# EAGLE design Lattepanda_shild_v1 (EAGLE 6.5.0)
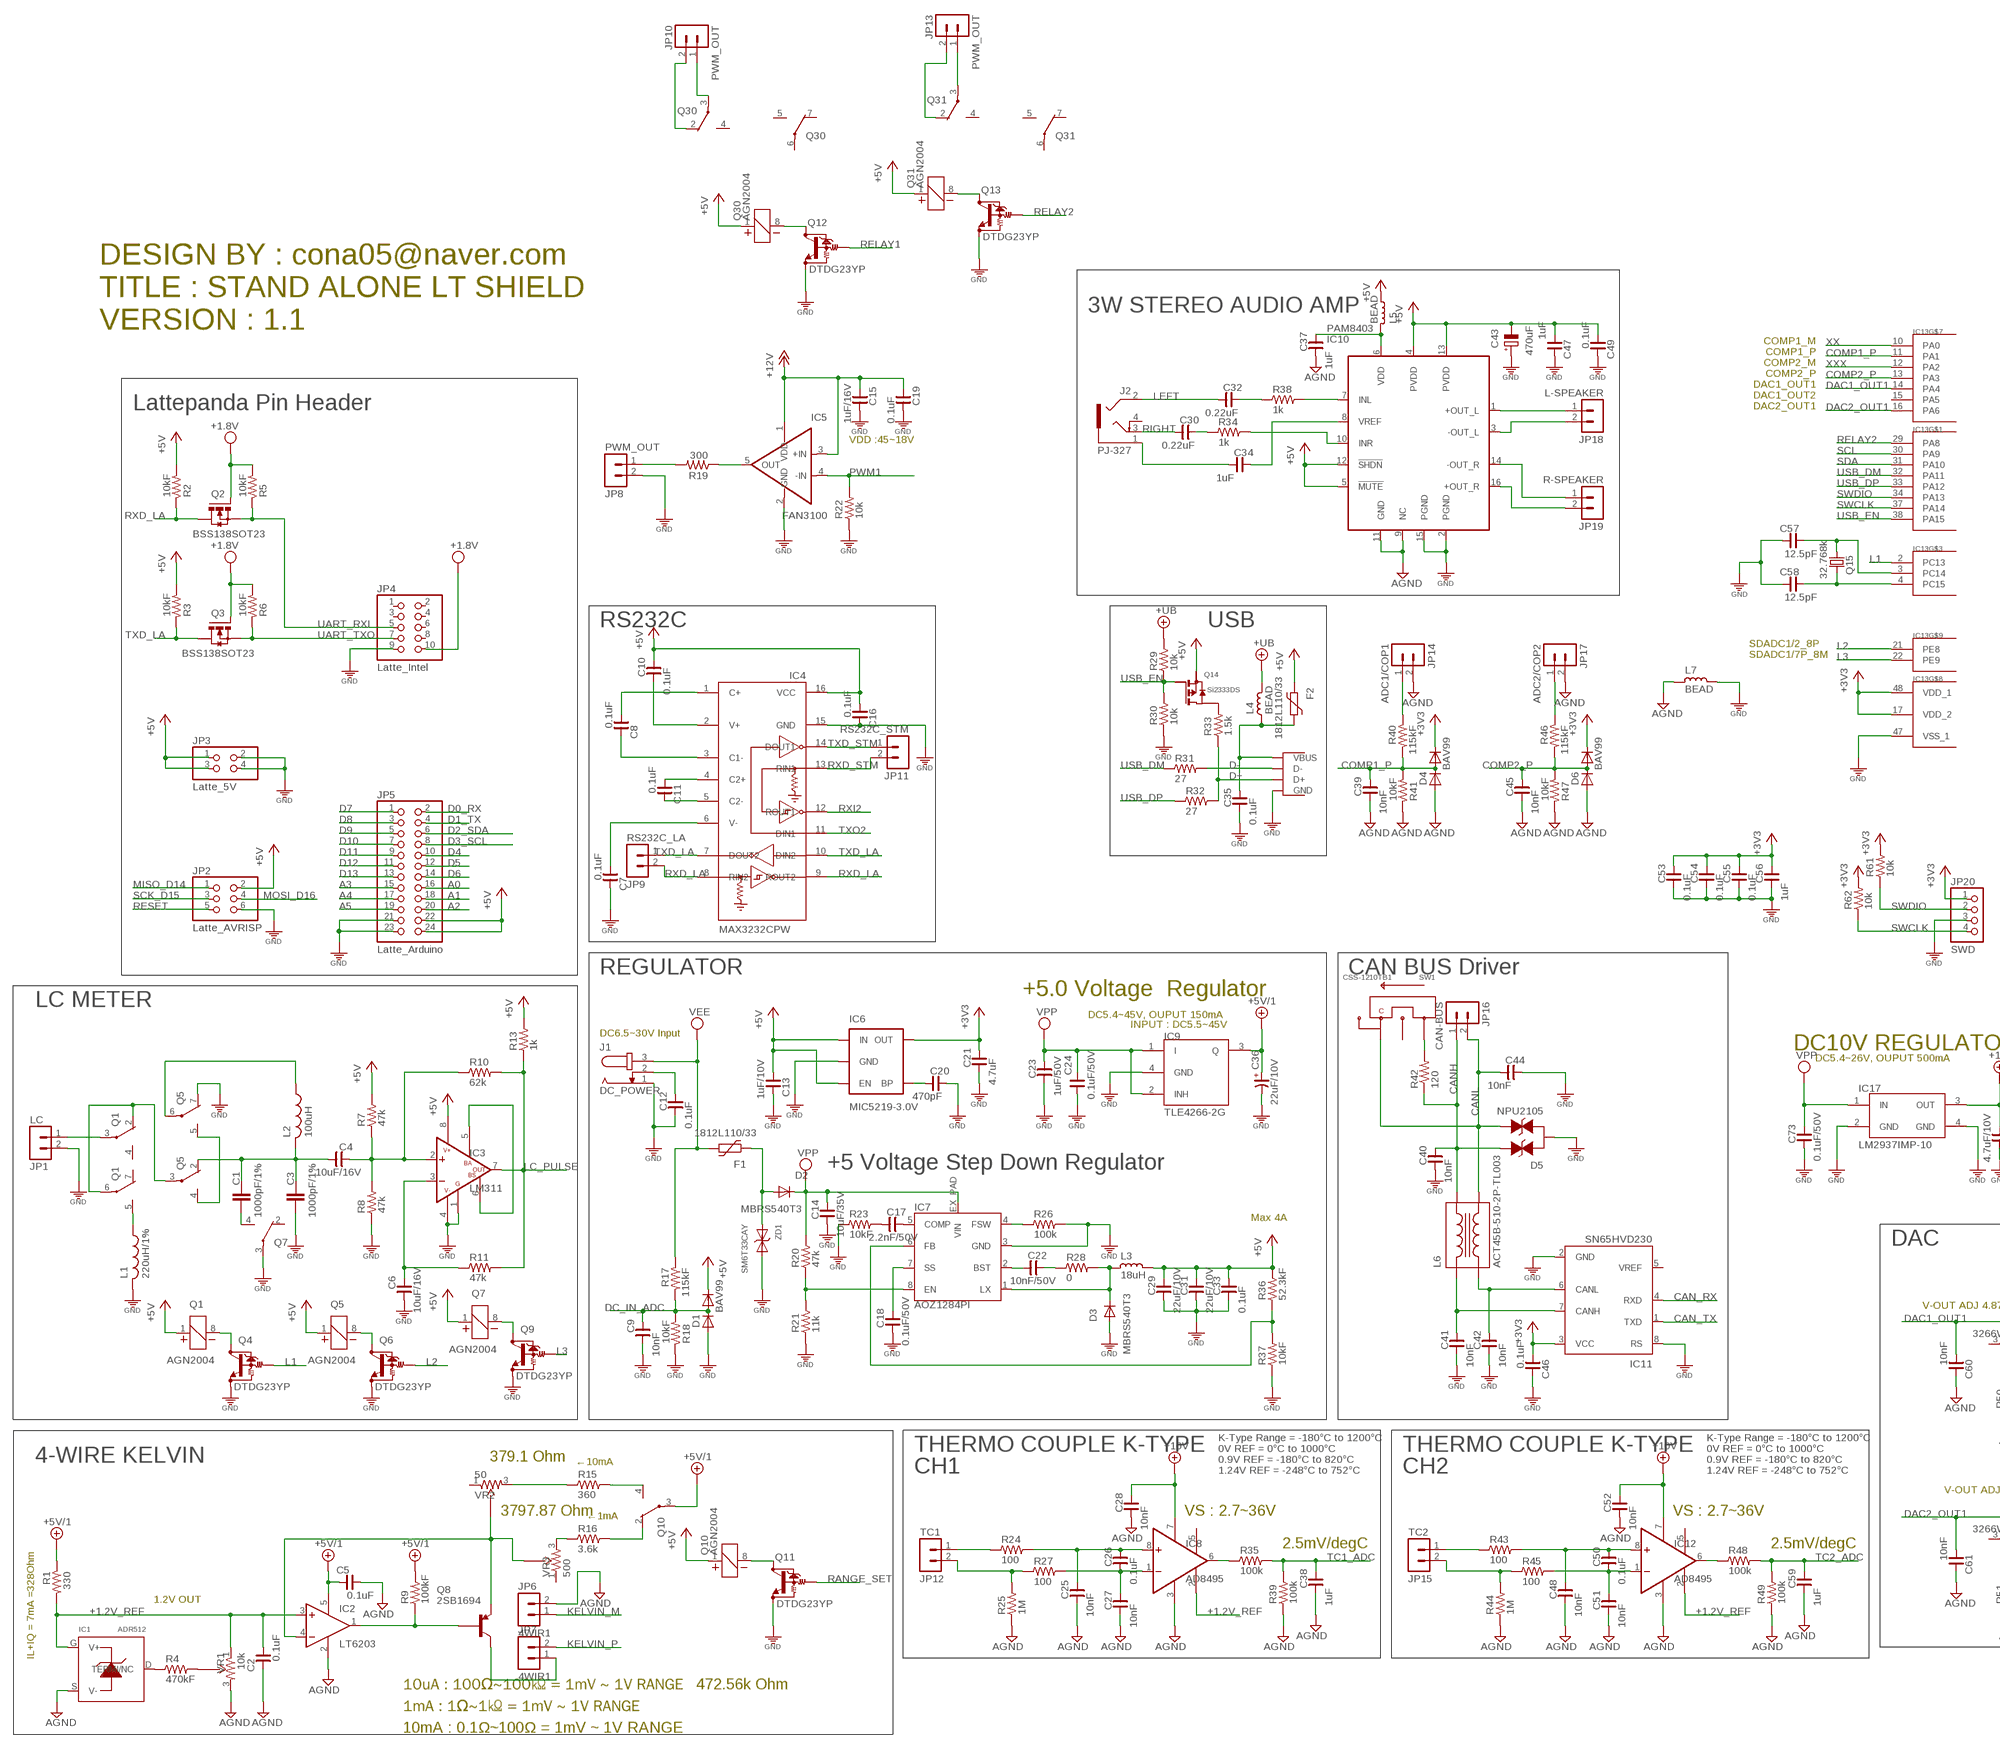
[diagram p0: schematic, sheet 1, part 1 of 2]
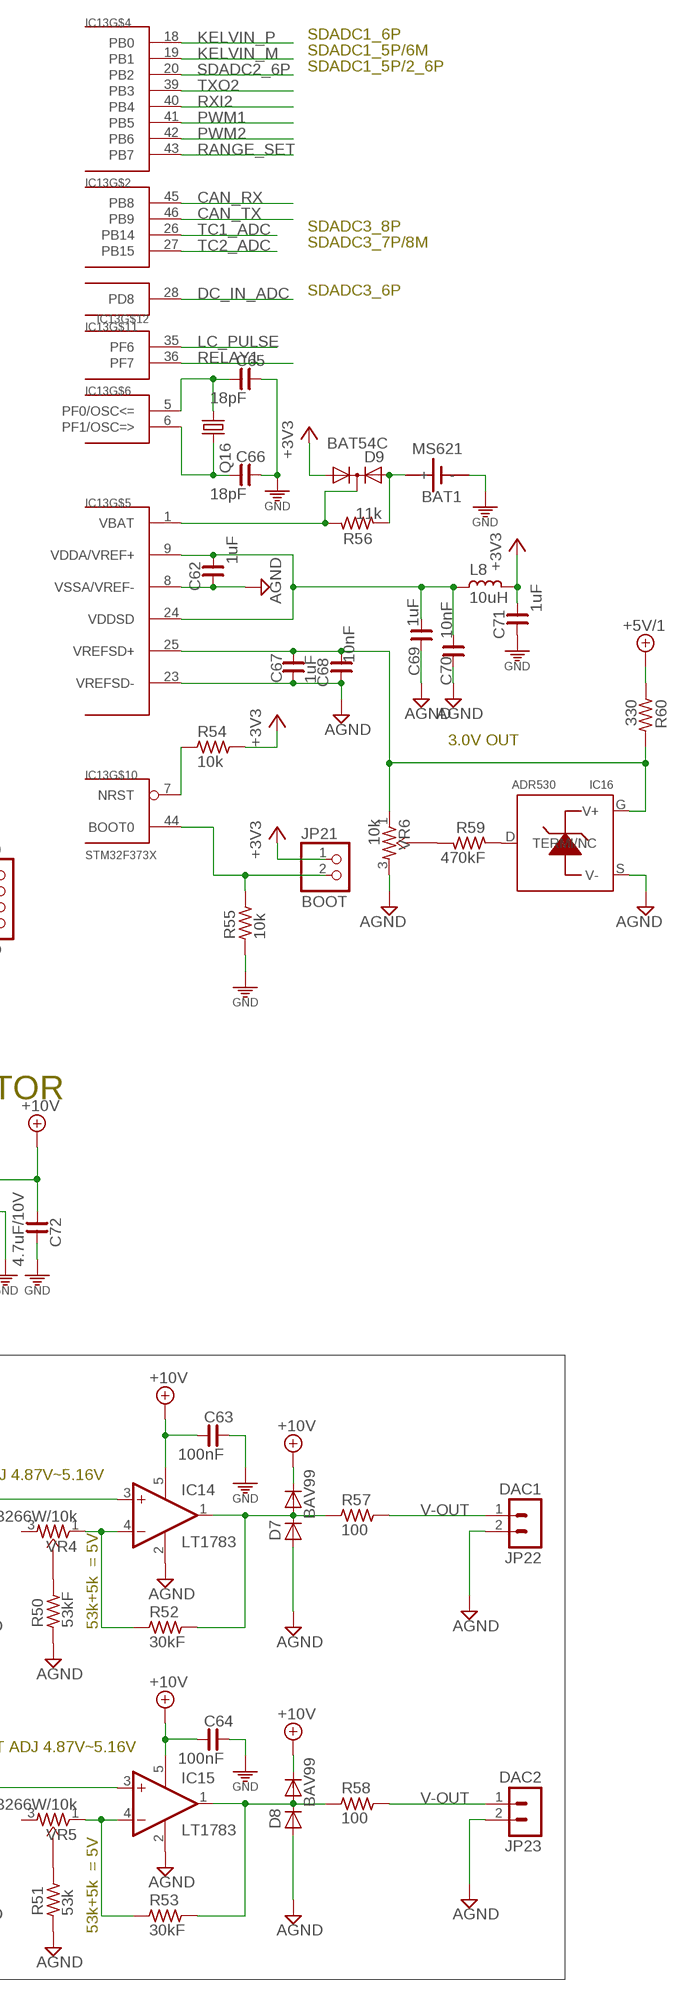
[diagram p1: schematic, sheet 1, part 2 of 2]

## Parts
BAT1  MS621  MS614  [MS621]
C1  1000pF/1%  C-EU050-025X075  [C050-025X075]
C2  0.1uF  C_0603  [C0603]
C3  1000pF/1%  C-EU050-025X075  [C050-025X075]
C4  10uF/16V  C_3216  [C3216]
C5  0.1uF  C_0603  [C0603]
C6  10uF/16V  C_3216  [C3216]
C7  0.1uF  C_0603  [C0603]
C8  0.1uF  C_0603  [C0603]
C9  10nF  C_0603  [C0603]
C10  0.1uF  C_0603  [C0603]
C11  0.1uF  C_0603  [C0603]
C12  0.1uF  C_0603  [C0603]
C13  1uF/10V  C_0603  [C0603]
C14  10uF/35V  C_3225  [C3225]
C15  1uF/16V  C_0805  [C0805]
C16  0.1uF  C_0603  [C0603]
C17  2.2nF/50V  C_0603  [C0603]
C18  0.1uF/50V  C_0603  [C0603]
C19  0.1uF  C_0603  [C0603]
C20  470pF  C_0603  [C0603]
C21  4.7uF  C_2012  [C2012]
C22  10nF/50V  C_0603  [C0603]
C23  1uF/50V  C_2012  [C2012]
C24  0.1uF/50V  C_0603  [C1608-]
C25  10nF  C_0603  [C0603]
C26  0.1uF  C_0603  [C0603]
C27  10nF  C_0603  [C0603]
C28  10nF  C_0603  [C0603]
C29  22uF/10V  C_3216  [C3216]
C30  0.22uF  C_0603  [C0603]
C31  22uF/10V  C_3216  [C3216]
C32  0.22uF  C_0603  [C0603]
C33  0.1uF  C_0603  [C0603]
C34  1uF  C_0603  [C0603]
C35  0.1uF  C_0603  [C0603]
C36  22uF/10V  CP_3528-21  [C3528-21/T]
C37  1uF  C_0603  [C0603]
C38  1uF  C_0603  [C0603]
C39  10nF  C_0603  [C0603]
C40  10nF  C_0603  [C0603]
C41  10nF  C_0603  [C0603]
C42  10nF  C_0603  [C0603]
C43  470uF  CPOL-EUD/7343-31W  [D/7343-31W]
C44  10nF  C_0603  [C0603]
C45  10nF  C_0603  [C0603]
C46  0.1uF  C_0603  [C0603]
C47  1uF  C_0603  [C0603]
C48  10nF  C_0603  [C0603]
C49  0.1uF  C_0603  [C0603]
C50  0.1uF  C_0603  [C0603]
C51  10nF  C_0603  [C0603]
C52  10nF  C_0603  [C0603]
C53  0.1uF  C_0603  [C0603]
C54  0.1uF  C_0603  [C0603]
C55  0.1uF  C_0603  [C0603]
C56  1uF  C_0603  [C0603]
C57  12.5pF  C_0603  [C0603]
C58  12.5pF  C_0603  [C0603]
C59  1uF  C_0603  [C0603]
C60  10nF  C_0603  [C0603]
C61  10nF  C_0603  [C0603]
C62  1uF  C_0603  [C0603]
C63  100nF  C_0603  [C0603]
C64  100nF  C_0603  [C0603]
C65  18pF  C_0603  [C0603]
C66  18pF  C_0603  [C0603]
C67  1uF  C_0603  [C0603]
C68  10nF  C_0603  [C0603]
C69  1uF  C_0603  [C0603]
C70  10nF  C_0603  [C0603]
C71  1uF  C_0603  [C0603]
C72  4.7uF/10V  C_2012  [C2012]
C73  0.1uF/50V  C_0603  [C0603]
D1  BAV99  [SOT23]
D2  MBRS540T3  DIODE-SMC  [SMC]
D3  MBRS540T3  DIODE-SMC  [SMC]
D4  BAV99  [SOT23]
D5  NPU2105  [SOT23]
D6  BAV99  [SOT23]
D7  BAV99  [SOT23]
D8  BAV99  [SOT23]
D9  BAT54C  [SOT23]
F1  1812L110/33  1812L  [1812L]
F2  1812L110/33  1812L  [1812L]
IC1  ADR512  ADR510  [SOT23]
IC2  LT6203  TS507S  [SOT23-5L]
IC3  LM311  [SO8]
IC4  MAX3232CPW  MAX3232MAX232CPW  [PW_R-PDSO-G16]
IC5  FAN3100  [SOT23-5L_FAN3100]
IC6  MIC5219-3.0V  V_REG_LDOSMD  [SOT23-5]
IC7  AOZ1284PI  [S08-EP1]
IC8  AD8495  AD849X  [MSOP8]
IC9  TLE4266-2G  TLE4266G  [SOT223-4]
IC10  PAM8403  [SOIC16N]
IC11  SN65HVD230  PCA82C250T  [SO8]
IC12  AD8495  AD849X  [MSOP8]
IC13  STM32F373X  [TQFP48]
IC14  LT1783  LT1783M5  [SOT23-5]
IC15  LT1783  LT1783M5  [SOT23-5]
IC16  ADR530  ADR510  [SOT23]
IC17  LM2937IMP-10  LM2937  [SOT223]
J1  DC_POWER  JACK-PLUG0  [SPC4077]
J2  PJ-327  AUDIO_JACK2  [PJ-327-2]
JP1  LC  MA02ED350V-02P  [ED350V-02P]
JP2  Latte_AVRISP  PINHD-2X3  [2X03]
JP3  Latte_5V  PINHD-2X2  [2X02]
JP4  Latte_Intel  PINHD-2X5M  [2X05M]
JP5  Latte_Arduino  PINHD-2X12SMD  [2X12_SMD]
JP6  4WIR1  MA02ED350V-02P  [ED350V-02P]
JP7  4WIR1  MA02ED350V-02P  [ED350V-02P]
JP8  PWM_OUT  MA02ED350V-02P  [ED350V-02P]
JP9  RS232C_LA  MA02ED350V-02P  [ED350V-02P]
JP10  PWM_OUT  MA02ED350V-02P  [ED350V-02P]
JP11  RS232C_STM  MA02ED350V-02P  [ED350V-02P]
JP12  TC1  MA02ED350V-02P  [ED350V-02P]
JP13  PWM_OUT  MA02ED350V-02P  [ED350V-02P]
JP14  ADC1/COP1  MA02ED350V-02P  [ED350V-02P]
JP15  TC2  MA02ED350V-02P  [ED350V-02P]
JP16  CAN-BUS  MA02ED350V-02P  [ED350V-02P]
JP17  ADC2/COP2  MA02ED350V-02P  [ED350V-02P]
JP18  L-SPEAKER  MA02ED350V-02P  [ED350V-02P]
JP19  R-SPEAKER  MA02ED350V-02P  [ED350V-02P]
JP20  SWD  PINHD-1X4M  [1X04M]
JP21  BOOT  PINHD-1X2M  [1X02M]
JP22  DAC1  MA02ED350V-02P  [ED350V-02P]
JP23  DAC2  MA02ED350V-02P  [ED350V-02P]
L1  220uH/1%  L-US0207/2V  [0207/2V]
L2  100uH  L-US0207/2V  [0207/2V]
L3  18uH  L_SHP1260P-F  [SHP1260P-F]
L4  BEAD  L_0805  [L0805]
L5  BEAD  L_0805  [L0805]
L6  ACT45B-510-2P-TL003  CHOKE_COIL  [ACT45B]
L7  BEAD  L_0603  [L0603]
L8  10uH  L_0805  [L0805]
Q1  AGN2004  RELAY_CH2AGN200X  [ANG200X]
Q2  BSS138SOT23  [SOT23]
Q3  BSS138SOT23  [SOT23]
Q4  DTDG23YP  [MPT3]
Q5  AGN2004  RELAY_CH2AGN200X  [ANG200X]
Q6  DTDG23YP  [MPT3]
Q7  AGN2004  RELAY_CH2AGN200X  [ANG200X]
Q8  2SB1694  [SOT323]
Q9  DTDG23YP  [MPT3]
Q10  AGN2004  RELAY_CH2AGN200X  [ANG200X]
Q11  DTDG23YP  [MPT3]
Q12  DTDG23YP  [MPT3]
Q13  DTDG23YP  [MPT3]
Q14  Si2333DS  P-FET  [SOT23]
Q15  32.768k  MC-306  [MC-306]
Q16  8MHz  CRYSTALSMD5032  [SMD5032]
Q30  AGN2004  RELAY_CH2AGN200X  [ANG200X]
Q31  AGN2004  RELAY_CH2AGN200X  [ANG200X]
R1  330  R_0603  [R0603]
R2  10kF  R_0603  [R0603]
R3  10kF  R_0603  [R0603]
R4  470kF  R_0603  [R0603]
R5  10kF  R_0603  [R0603]
R6  10kF  R_0603  [R0603]
R7  47k  R_0603  [R0603]
R8  47k  R_0603  [R0603]
R9  100kF  R_0603  [R0603]
R10  62k  R_0603  [R0603]
R11  47k  R_0603  [R0603]
R13  1k  R_0603  [R0603]
R15  360  R_0603  [R0603]
R16  3.6k  R_0603  [R0603]
R17  115kF  R_0603  [R0603]
R18  10kF  R_0603  [R0603]
R19  300  R_0603  [R0603]
R20  47k  R_0603  [R0603]
R21  11k  R_0603  [R0603]
R22  10k  R_0603  [R0603]
R23  10kF  R_0603  [R0603]
R24  100  R_0603  [R0603]
R25  1M  R_0603  [R0603]
R26  100k  R_0603  [R0603]
R27  100  R_0603  [R0603]
R28  0  R_0603  [R0603]
R29  10k  R_0603  [R0603]
R30  10k  R_0603  [R0603]
R31  27  R_0603  [R0603]
R32  27  R_0603  [R0603]
R33  1.5k  R_0603  [R0603]
R34  1k  R_0603  [R0603]
R35  100k  R_0603  [R0603]
R36  52.3kF  R_0603  [R0603]
R37  10kF  R_0603  [R0603]
R38  1k  R_0603  [R0603]
R39  100k  R_0603  [R0603]
R40  115kF  R_0603  [R0603]
R41  10kF  R_0603  [R0603]
R42  120  R-US_R1608  [R0603@1]
R43  100  R_0603  [R0603]
R44  1M  R_0603  [R0603]
R45  100  R_0603  [R0603]
R46  115kF  R_0603  [R0603]
R47  10kF  R_0603  [R0603]
R48  100k  R_0603  [R0603]
R49  100k  R_0603  [R0603]
R50  53kF  R_0603  [R0603]
R51  53k  R_0603  [R0603]
R52  30kF  R_0603  [R0603]
R53  30kF  R_0603  [R0603]
R54  10k  R_0603  [R0603]
R55  10k  R_0603  [R0603]
R56  11k  R_0603  [R0603]
R57  100  R_0603  [R0603]
R58  100  R_0603  [R0603]
R59  470kF  R_0603  [R0603]
R60  330  R_0603  [R0603]
R61  10k  R_0603  [R0603]
R62  10k  R_0603  [R0603]
SW1  CSS-1210TB1  [CSS-1210TB]
VR1  10k  R-TRIMMER-SMDBOUNS  [3266W]
VR2  50  R-TRIMMER-SMDBOUNS  [3266W]
VR3  500  R-TRIMMER-SMDBOUNS  [3266W]
VR4  3266W/10k  R-TRIMMER-SMDBOUNS  [3266W]
VR5  3266W/10k  R-TRIMMER-SMDBOUNS  [3266W]
VR6  10k  R-TRIMMER-SMDBOUNS  [3266W]
X1  USB-A-H  [USB-A-H]
ZD1  SM6T33CAY  ZDSM6T33CAY  [SMB]

## Nets
+1.2V_REF: C2.2 IC1.G(V+) IC2.3(+IN) IC8.2(REF) IC12.2(REF) R1.2 VR1.1
+3V3: C21.1 C46.2 C53.1 C54.1 C55.1 C56.1 C71.2 D4.S(C) D6.S(C) D9.G IC6.5(OUT) IC11.3(VCC) IC13.17(VDD_2) IC13.48(VDD_1) JP20.1 JP21.1 L8.1 R54.2 R61.2 R62.2
+5V: C10.1 C13.2 C16.2 C29.1 C31.1 C33.1 C43.- C47.2 C49.2 D1.S(C) F2.P$1 IC3.8(V+) IC4.16(VCC) IC6.1(IN) IC6.3(EN) IC10.4(PVDD) IC10.5(!MUTE) IC10.12(!SHDN) IC10.13(PVDD) JP2.2 JP3.1 JP3.3 JP5.22 JP5.24 L3.1 L5.1 Q1.1 Q5.1 Q7.1 Q10.1 Q14.S(SOURCE) Q30.1 Q31.1 R2.2 R3.2 R7.2 R13.2 R36.2
+5V/1: C5.1 C36.+ IC2.5(V+) IC9.3(Q) Q10.3(P) R1.1 R9.2 R60.1
+10V: C28.1 C52.1 C63.2 C64.2 C72.2 D7.S(C) D8.S(C) IC8.7(V+) IC12.7(V+) IC14.5(V+) IC15.5(V+) IC17.3(OUT)
+12V: C15.1 C19.1 IC5.1(VDD) IC5.3(+IN)
+UB: L4.1 R29.2
A0: JP5.16
A1: JP5.18
A2: JP5.20
A3: JP5.15
A4: JP5.17
A5: JP5.19
AGND: C2.1 C5.2 C25.2 C27.2 C28.2 C37.2 C38.2 C39.2 C45.2 C48.2 C51.2 C52.2 C59.2 C60.1 C61.1 C62.1 C67.2 C68.1 C69.1 C70.1 D4.G(A) D6.G(A) D7.G(A) D8.G(A) IC1.S(V-) IC2.2(V-) IC8.3(V-) IC10.9(NC) IC10.11(GND) IC12.3(V-) IC13.8(VSSA/VREF-) IC13.23(VREFSD-) IC14.2(V-) IC15.2(V-) IC16.S(V-) JP6.2 JP14.2 JP17.2 JP22.2 JP23.2 L7.2 R25.1 R39.1 R41.1 R44.1 R47.1 R49.1 R50.1 R51.1 VR1.3 VR6.3
BOOT1: IC13.44(BOOT0) JP21.2 R55.2
CAN_RX: IC11.4(RXD) IC13.45(PB8)
CAN_TX: IC11.1(TXD) IC13.46(PB9)
CANH: C40.1 D5.G(PIN1) JP16.1 L6.4 R42.1
CANL: C44.2 D5.S(PIN2) JP16.2 L6.3 SW1.3
COMP1_P: C39.1 D4.D(AC) IC13.11(PA1) R40.2 R41.2
COMP2_P: C45.1 D6.D(AC) IC13.13(PA3) R46.2 R47.2
D0_RX: JP5.2
D1_TX: JP5.4
D2_SDA: JP5.6
D3_SCL: JP5.8
D4: JP5.10
D5: JP5.12
D6: JP5.14
D7: JP5.1
D8: JP5.3
D9: JP5.5
D10: JP5.7
D11: JP5.9
D12: JP5.11
D13: JP5.13
D+: R32.2 R33.1 X1.D+
D-: R31.2 X1.D-
DAC1_OUT1: C60.2 IC13.14(PA4) IC14.3(+IN)
DAC2_OUT1: C61.2 IC13.16(PA6) IC15.3(+IN)
DC-IN: D2.A F1.P$1 ZD1.A
DC_IN_ADC: C9.1 D1.D(AC) IC13.28(PD8) R17.2 R18.2
GND [GND]: BAT1.- C3.2 C6.2 C7.1 C9.2 C12.2 C13.1 C14.2 C15.2 C16.1 C18.2 C19.2 C20.1 C21.2 C23.2 C24.1 C29.2 C31.2 C33.2 C35.2 C36.- C40.2 C41.2 C42.2 C43.+ C44.1 C46.1 C47.1 C49.1 C53.2 C54.2 C55.2 C56.2 C57.1 C58.1 C63.1 C64.1 C65.1 C66.1 C71.1 C72.1 C73.2 D1.G(A) D3.A D5.D(PIN3) IC3.1(G) IC3.4(V-) IC4.15(GND) IC5.2(GND) IC6.2(GND) IC7.3(GND) IC9.4(GND) IC10.2(PGND) IC10.15(PGND) IC11.2(GND) IC11.8(RS) IC13.47(VSS_1) IC17.2(GND) IC17.4(GND) J1.1 JP1.2 JP2.6 JP3.2 JP3.4 JP4.9 JP5.21 JP5.23 JP8.2 JP20.3 L1.2 L7.1 Q4.EMITTER(GND) Q5.7(O) Q6.EMITTER(GND) Q7.3(P) Q9.EMITTER(GND) Q11.EMITTER(GND) Q12.EMITTER(GND) Q13.EMITTER(GND) R8.1 R18.1 R21.1 R22.1 R23.1 R26.2 R30.1 R37.1 R55.1 X1.GND ZD1.C(K)
KELVIN_M: IC13.19(PB1) JP6.1
KELVIN_P: IC13.18(PB0) JP7.2
L1: IC13.2(PC13) Q4.BASE(IN)
L2: IC13.21(PE8) Q6.BASE(IN)
L3: IC13.22(PE9) Q9.BASE(IN)
LC_PULSE: IC3.7(OUT) IC13.35(PF6) R10.2 R11.2 R13.1
LEFT: C32.2 J2.2
MISO_D14: JP2.1
MOSI_D16: JP2.4
N$1: C50.2 C51.1 IC12.1(-IN) R45.2
N$2: IC16.D(TERMI/NC) R59.1
N$3: IC7.6(FB) R36.1 R37.2
N$4: C22.2 IC7.2(BST)
N$5: C42.1 IC11.6(CANL) L6.2
N$6: C41.1 IC11.7(CANH) L6.1
N$7: R16.1 VR3.3
N$8: C22.1 R28.1
N$9: D3.C IC7.1(LX) L3.2 R28.2
N$10: C17.1 IC7.5(COMP)
N$11: C17.2 R23.2
N$12: R42.2 SW1.1
N$13: C48.1 C50.1 IC12.8(+IN) R43.2
N$14: C11.1 IC4.5(C2-)
N$15: C11.2 IC4.4(C2+)
N$16: C10.2 IC4.2(V+)
N$17: IC14.4(-IN) R52.1 VR4.1
N$18: D7.D(AC) IC14.1(OUT) R52.2 R57.1
N$19: IC7.8(EN) R20.1 R21.2
N$20: IC5.5(OUT) R19.1
N$21: IC7.4(FSW) R26.1
N$22: R50.2 VR4.2
N$23: IC15.4(-IN) R53.1 VR5.1
N$24: C18.1 IC7.7(SS)
N$25: D9.D IC13.1(VBAT) R56.1
N$26: C7.2 IC4.6(V-)
N$27: C8.2 IC4.1(C+)
N$28: JP8.1 R19.2
N$29: C8.1 IC4.3(C1-)
N$30: IC2.1(OUT) Q8.2(B) R9.1
N$31: Q12.COLLECTOR(OUT) Q30.8
N$32: D8.D(AC) IC15.1(OUT) R53.2 R58.1
N$33: R59.2 VR6.2
N$34: IC13.7(NRST) R54.1
N$35: C66.2 IC13.6(PF1/OSC=>) Q16.3
N$36: JP15.2 R44.2 R45.1
N$37: IC3.5(BA) IC3.6(BS)
N$38: C62.2 C69.2 C70.2 IC13.9(VDDA/VREF+) IC13.24(VDDSD) L8.2
N$39: C6.1 IC3.3(-IN) R11.1
N$40: R51.2 VR5.2
N$41: C26.2 C27.1 IC8.1(-IN) R27.2
N$42: C25.1 C26.1 IC8.8(+IN) R24.2
N$43: IC10.7(INL) R38.2
N$44: IC10.1(+OUT_L) JP18.1
N$45: JP12.2 R25.2 R27.1
N$46: JP12.1 R24.1
N$47: IC8.6(OUT) R35.1
N$48: C4.1 IC3.2(+IN) R7.1 R8.2 R10.1
N$49: JP7.1 Q8.3(C)
N$50: JP14.1 R40.1
N$51: JP17.1 R46.1
N$52: IC10.3(-OUT_L) JP18.2
N$53: IC10.14(-OUT_R) JP19.1
N$54: IC10.16(+OUT_R) JP19.2
N$55: IC10.10(INR) R34.2
N$56: C34.1 IC10.8(VREF)
N$57: C34.2 J2.1
N$58: C32.1 R38.1
N$59: C35.1 F2.P$2 L4.2 X1.VBUS
N$60: Q14.D(DRAIN) R33.2
N$61: IC1.D(TERMI/NC) R4.1
N$62: C20.2 IC6.4(BP)
N$63: R4.2 VR1.2
N$64: R15.1 VR2.3
N$65: C30.1 R34.1
N$66: Q10.8 Q11.COLLECTOR(OUT)
N$67: Q10.4(S) R15.2
N$68: C67.1 C68.2 IC13.25(VREFSD+) IC16.G(V+) R60.2 VR6.1
N$69: C37.1 IC10.6(VDD) L5.2
N$70: IC2.4(-IN) Q8.1(E) VR2.2 VR3.2
N$71: C12.1 J1.2
N$72: Q10.2(O) R16.2
N$73: Q5.4(S) Q5.5(S)
N$74: C1.1 C3.1 C4.2 L2.2 Q5.2(O)
N$75: Q7.8 Q9.COLLECTOR(OUT)
N$76: Q5.8 Q6.COLLECTOR(OUT)
N$77: Q1.2(O) Q1.6(P) Q5.3(P)
N$78: C1.2 Q7.4(S)
N$79: L2.1 Q5.6(P)
N$80: Q1.8 Q4.COLLECTOR(OUT)
N$81: JP15.1 R43.1
N$82: L1.1 Q1.5(S)
N$83: JP1.1 Q1.3(P)
N$84: IC12.6(OUT) R48.1
N$85: Q13.COLLECTOR(OUT) Q31.8
N$86: JP10.1 Q30.3(P)
N$87: C65.2 IC13.5(PF0/OSC<=) Q16.1
N$88: JP10.2 Q30.2(O)
N$89: JP13.1 Q31.3(P)
N$90: JP13.2 Q31.2(O)
N$92: BAT1.+ D9.S R56.2
N$95: C57.2 IC13.3(PC14) Q15.1
N$96: C58.2 IC13.4(PC15) Q15.4
PWM1: IC5.4(-IN) IC13.41(PB5) R22.2
PWM2: IC13.42(PB6)
RANGE_SET: IC13.43(PB7) Q11.BASE(IN)
RELAY1: IC13.36(PF7) Q12.BASE(IN)
RELAY2: IC13.29(PA8) Q13.BASE(IN)
RESET: JP2.5
RIGHT: C30.2 J2.3
RXD_LA: IC4.8(RIN2) IC4.9(ROUT2) JP9.2 Q2.D R2.1
RXD_STM: IC4.13(RIN1) JP11.2
RXI2: IC4.12(ROUT1) IC13.40(PB4)
SCK_D15: JP2.3
SCL: IC13.30(PA9)
SDA: IC13.31(PA10)
SDADC2_6P: IC13.20(PB2)
SWCLK: IC13.37(PA14) JP20.4 R62.1
SWDIO: IC13.34(PA13) JP20.2 R61.1
TC1_ADC: C38.1 IC13.26(PB14) R35.2 R39.2
TC2_ADC: C59.1 IC13.27(PB15) R48.2 R49.2
TXD_LA: IC4.7(DOUT2) IC4.10(DIN2) JP9.1 Q3.D R3.1
TXD_STM: IC4.14(DOUT1) JP11.1
TXO2: IC4.11(DIN1) IC13.39(PB3)
UART_RXI: JP4.5 Q2.S R5.1
UART_TXO: JP4.7 Q3.S R6.1
USB_DM: IC13.32(PA11) R31.1
USB_DP: IC13.33(PA12) R32.1
USB_EN: IC13.38(PA15) Q14.G(GATE) R29.1 R30.2
V-OUT: JP22.1 JP23.1 R57.2 R58.2
VDD: JP4.10 Q2.G Q3.G R5.2 R6.2 ; supply symbol labelled +1.8V
VEE: F1.P$2 J1.3 R17.1
VPP: C14.1 C23.1 C24.2 C73.1 D2.C IC7.EX_PAD(VIN) IC9.1(I) IC9.2(INH) IC17.1(IN) R20.2
XX: IC13.10(PA0)
XXX: IC13.12(PA2)
Unconnected: IC8.5(SENS) IC11.5(VREF) IC12.5(SENS) IC13.15(PA5) J2.4 JP4.1 JP4.2 JP4.3 JP4.4 JP4.6 JP4.8 Q1.4(S) Q1.7(O) Q7.2(O) Q7.5(S) Q7.6(P) Q7.7(O) Q10.5(S) Q10.6(P) Q10.7(O) Q30.4(S) Q30.5(S) Q30.6(P) Q30.7(O) Q31.4(S) Q31.5(S) Q31.6(P) Q31.7(O) SW1.2 VR2.1 VR3.1 VR4.3 VR5.3

## Notes on the sheet
- DESIGN BY : cona05@naver.com
- TITLE : STAND ALONE LT SHIELD
- 3W STEREO AUDIO AMP
- SDADC1_6P
- VERSION : 1.1
- SDADC1_5P/6M
- COMP1_M | SDADC1_5P/2_6P
- COMP1_P
- COMP2_M
- COMP2_P
- DAC1_OUT1
- DAC1_OUT2
- Lattepanda Pin Header | DAC2_OUT1
- VDD :45~18V
- SDADC3_8P
- SDADC3_7P/8M
- SDADC3_6P
- RS232C | USB
- SDADC1/2_8P
- SDADC1/7P_8M
- 3.0V OUT
- REGULATOR | CAN BUS Driver
- +5.0 Voltage  Regulator
- LC METER
- DC5.4~45V, OUPUT 150mA
- DC6.5~30V Input | INPUT : DC5.5~45V
- DC10V REGULATOR
- DC5.4~26V, OUPUT 500mA
- +5 Voltage Step Down Regulator
- Max 4A
- DAC
- V-OUT ADJ 4.87V~5.16V
- 53k+5k  = 5V
- K-Type Range = -180°C to 1200°C | K-Type Range = -180°C to 1200°C
- THERMO COUPLE K-TYPE | 0V REF = 0°C to 1000°C | THERMO COUPLE K-TYPE | 0V REF = 0°C to 1000°C
- 4-WIRE KELVIN | 379.1 Ohm | 0.9V REF = -180°C to 820°C | 0.9V REF = -180°C to 820°C
- ←10mA
- CH1 | 1.24V REF = -248°C to 752°C | CH2 | 1.24V REF = -248°C to 752°C
- V-OUT ADJ 4.87V~5.16V
- 3797.87 Ohm | VS : 2.7~36V | VS : 2.7~36V
- ←1mA
- 2.5mV/degC | 2.5mV/degC
- 1.2V OUT
- 53k+5k  = 5V
- IL+IQ = 7mA =328Ohm
- 10uA : 100Ω~100㏀ = 1mV ~ 1V RANGE | 472.56k Ohm
- 1mA : 1Ω~1㏀ = 1mV ~ 1V RANGE
- 10mA : 0.1Ω~100Ω = 1mV ~ 1V RANGE

## Library data of the parts
BAT1 = cona_lib:MS614: SII Micro Battery
C1 C3 = rcl:C-EU: CAPACITOR, European symbol
C2 C4-C23 C25-C35 C37-C42 C44-C73 = cona_lib:C_: NON-POLARIZED CAP
C24 = GRU-EURO6:C_: NON-POLARIZED CAP
C36 = rc-master-smd:CP_: POLARIZED CAP
C43 = cona_lib:CPOL-EU: POLARIZED CAPACITOR, European symbol
D1 D4 D6-D8 = cona_lib:BAV99
D2 D3 = diode:DIODE-: DIODE
D5 = cona_lib:NPU2105
D9 = cona_lib:BAT54C
F1 F2 = ptc-littlefuse:1812L
IC1 IC16 = cona_lib:ADR510
IC2 = cona_lib:TS507: High precision rail-to-rail operational amplifier Ultra low offset voltage: 25 µV typ, 100 µV max
IC3 = cona_lib:LM311
IC4 = cona_lib:MAX3232: TI
IC5 = cona_lib:FAN3100
IC6 = SparkFun:V_REG_LDO: Voltage Regulator LDO Standard 150mA LDO voltage regulator in SOT-23 layout. Micrel part MIC5205. BP (by-pass) pin is used to lower output noise with 470pF cap.
IC7 = cona_lib:AOZ1284PI
IC8 IC12 = cona_lib:AD849X
IC9 = GRU-EURO6:TLE4266G
IC10 = cona_lib:PAM8403
IC11 = cona_lib:PCA82C250: CAN CONTROLLER INTERFACE
IC13 = stm32:STM32F373X
IC14 IC15 = GRU-EURO6:LT1783: General Purpose, Low Voltage, Rail-to-Rail Output Operational Amplifiers Source: http://www.national.com/mpf/LM/LMV321.html http://www.national.com/dt/lmv_qual.pdf
IC17 = cona_lib:LM2937
J1 = con-jack:JACK-PLUG: DC POWER JACK Power Jack, DC, Right Angle, Through Hole, Rated 5A at 16VDC, PC Terminals Distributor: Farnell (www.Farnell.de) Drawing: 84N1161.pdf / 84N1162.pdf Manufacturer: SPC Technology (www.spctechnology.com) Type: SPC4077 / SPC 4078
J2 = cona_lib:AUDIO_JACK2
JP1 JP6-JP19 JP22 JP23 = cona_lib:MA02
JP2 = pinhead:PINHD-2X3: PIN HEADER
JP3 = pinhead:PINHD-2X2: PIN HEADER
JP4 = pinhead:PINHD-2X5: PIN HEADER
JP5 = pinhead_254:PINHD-2X12: PIN HEADER
JP20 = pinhead:PINHD-1X4: PIN HEADER
JP21 = pinhead:PINHD-1X2: PIN HEADER
L1 L2 = rcl:L-US: INDUCTOR, American symbol
L3-L5 L7 L8 = cona_lib:L_: INDUCTOR
L6 = cona_lib:CHOKE_COIL
Q1 Q5 Q7 Q10 Q30 Q31 = cona_lib:RELAY_CH2
Q2 Q3 = cona_lib:BSS138: N-Channel Logic Level Enhancement Mode Field Effect Transistor
Q4 Q6 Q9 Q11-Q13 = cona_lib:DTDG23YP
Q8 = cona_lib:2SB1694
Q14 = cona_lib:P-FET
Q15 = crystal:MC-306: kHz RANGE CRYSTAL UNIT SMD Source: MC-306_405_406_E07X.PDF Homepage <http://www.epsontoyocom.co.jp>; MPN: MC-306 60.0KHZ 100PPM ,12.5PF; OC_FARNELL: 1278040; OC_NEWARK: 31M5576
Q16 = cona_lib:CRYSTAL: CRYSTAL
R1-R11 R13 R15-R41 R43-R62 = cona_lib:R_: RESISTOR
R42 = cona_lib:R-US_: RESISTOR, American symbol
SW1 = cona_lib:CSS-1210TB
VR1-VR6 = cona_lib:R-TRIMMER-SMD: SMD R-TRIMMER
X1 = CH_connectors:USB: USB Connectors USB-B-PTH is C@H proven USB-A-H is C@H proven
ZD1 = GRU-EURO6:ZD

## Net classes
0 default: clearance 0.152 mm
1 power: width 0.152 mm
2 GND: width 0.152 mm, clearance 0.152 mm

## Board
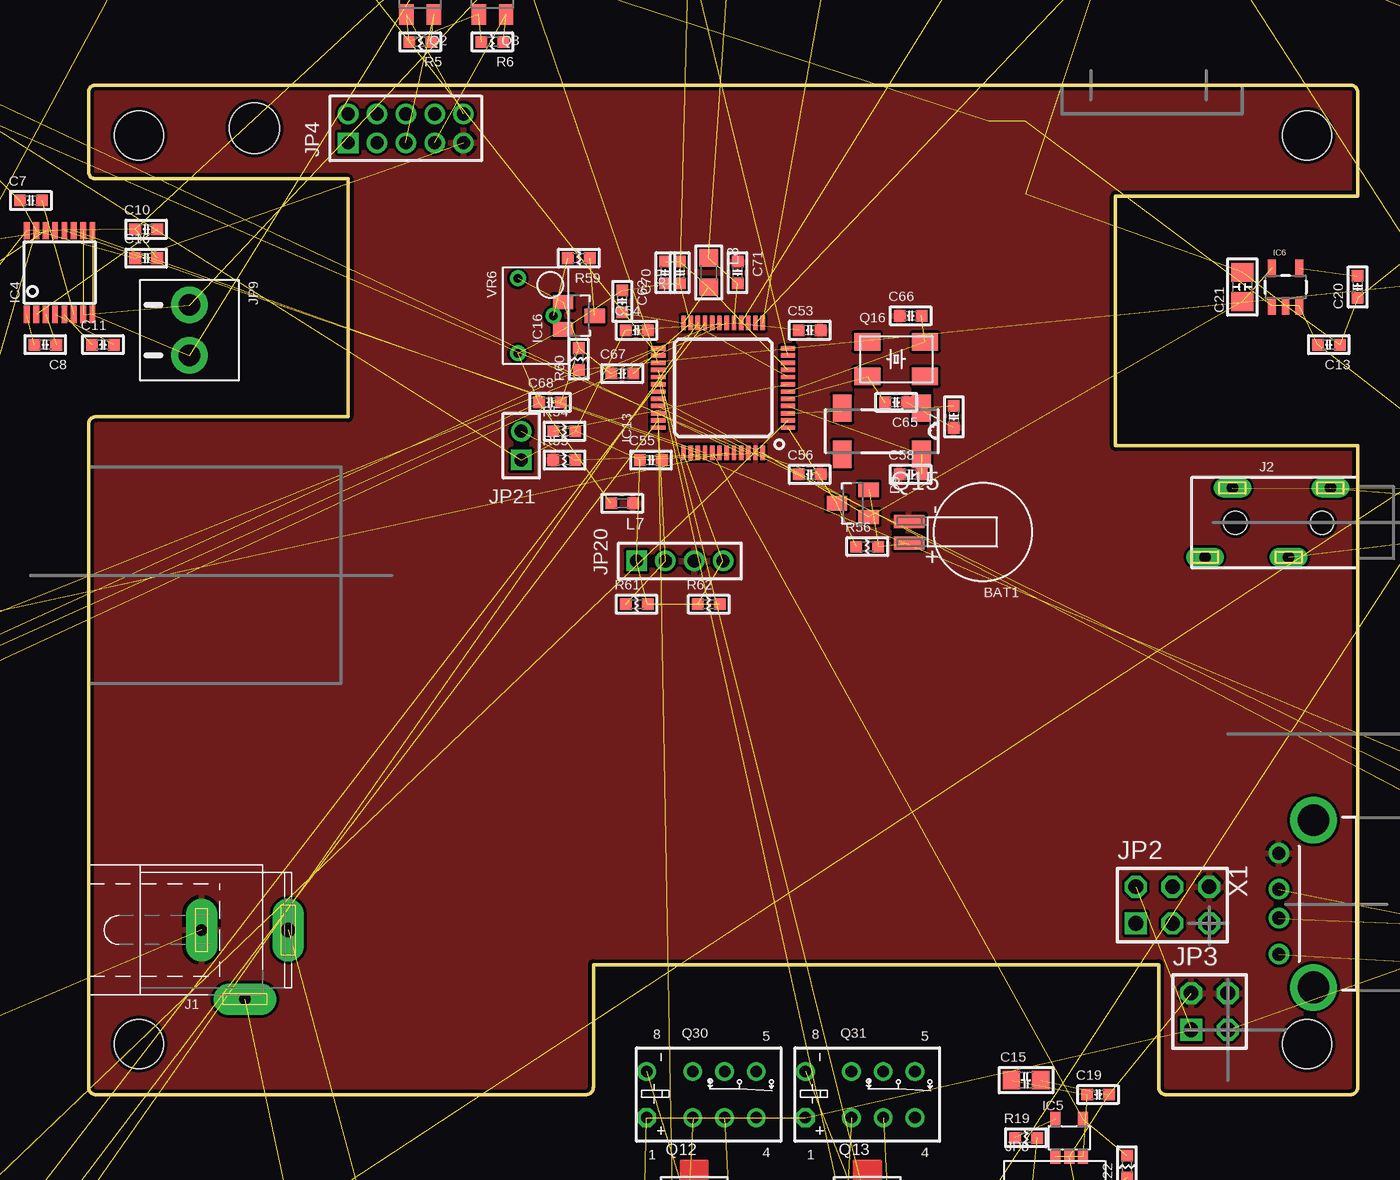
[diagram p2: board, top side]
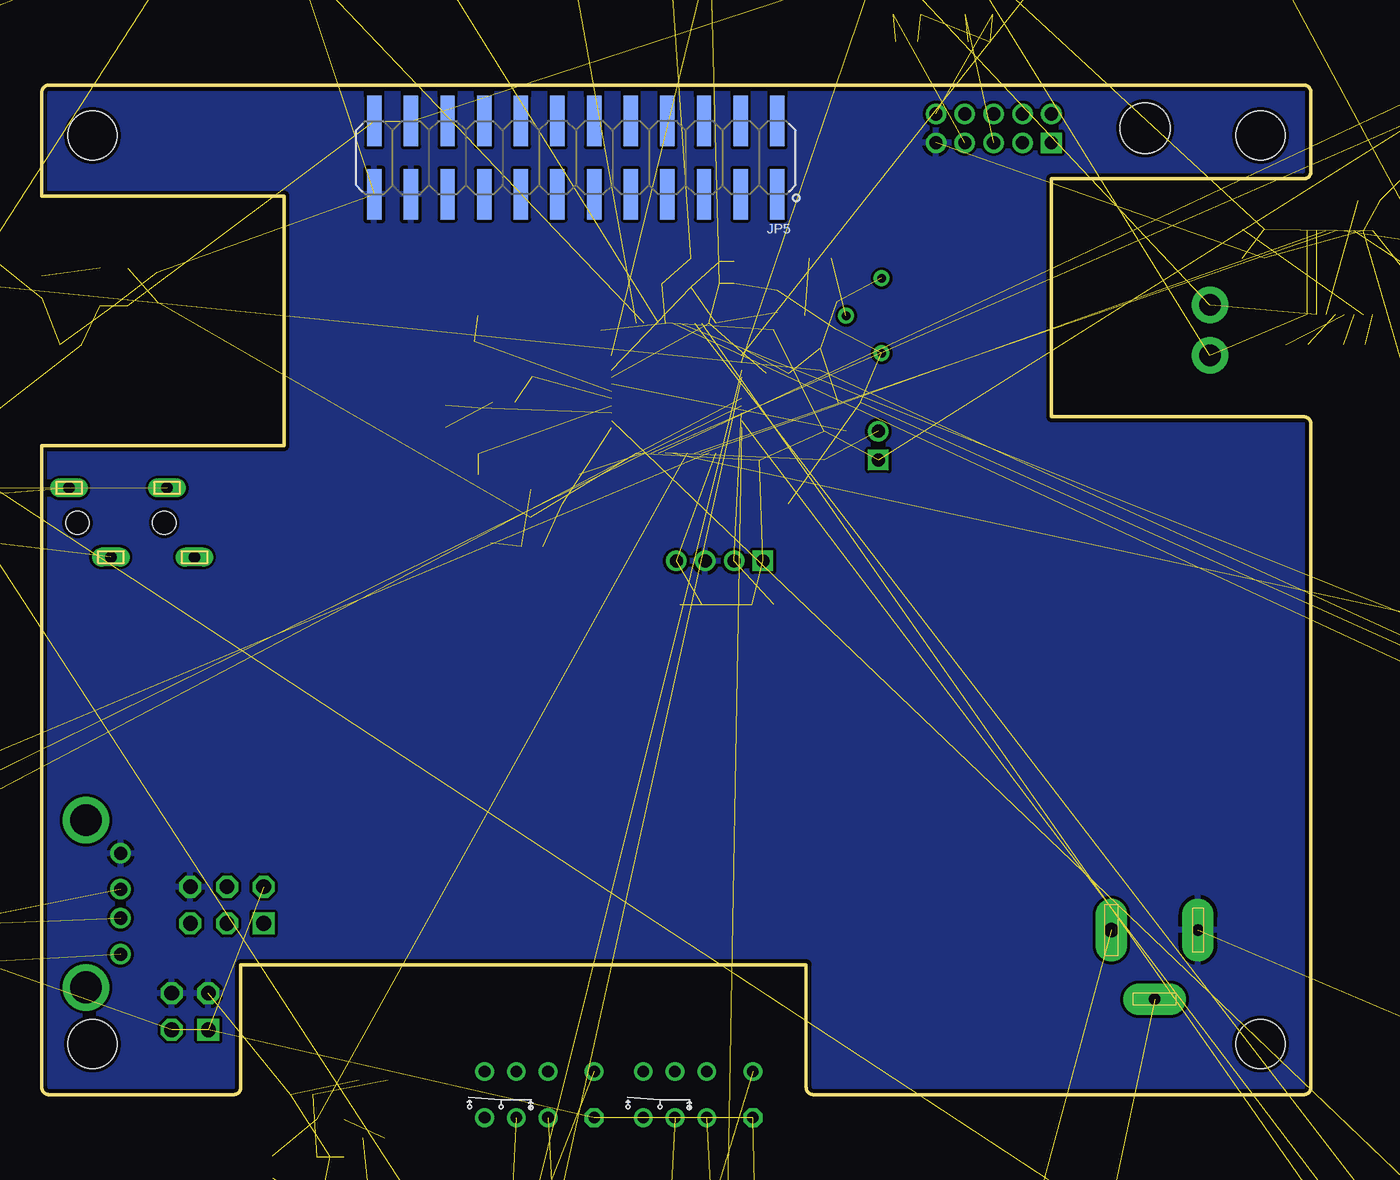
[diagram p3: board, bottom side, seen from below]

Size 88 x 70 mm. Coordinates in mm from the lower left corner, seen from the top.
Outline: 87.5,70 0.5,70 arc90 0,69.5 0,64 arc90 0.5,63.5 18,63.5 18,47 0.5,47 arc90 0,46.5 0,0.5 arc90 0.5,0 34.5,0 arc90 35,0.5 35,9 74.2,9 74.2,0.5 arc90 74.7,0 87.5,0 arc90 88,0.5 88,45 71.2,45 71.2,62.3 88,62.3 88,69.5 arc90 87.5,70
Copper layers (1*16): Top 0.035mm / dielectric 1.5mm / Bottom 0.035mm
Design rules "KHC_mm": minimum track width 0.2mm, minimum drill 0.3mm, track to track 0.2mm, track to pad 0.2mm, pad to pad 0.2mm, via to via 0.2mm, smd to smd 0.2mm, copper to edge 10mil, drill to drill 0.2mm, minimum pad ring 10mil, minimum via ring 8mil, stop-mask expansion 4mil, vias tented up to drill 0mil, thermal gap 10mil
Holes 3.4 mm at 3.5,66.5 84.5,66.5 3.5,3.5 84.5,3.5
Holes 3.5 mm at 11.5,67

### Footprints (pad centres in the part's own frame; a part is rotated, then mirrored left to right if it is on the bottom)
MS621 = smd 2.1 x 0.9: + 5.1,0.75; - 5.1,-0.75
C050-025X075 = drill 0.813 octagon: 1 -2.54,0; 2 2.54,0
C0603 = smd 0.8 x 0.8: 1 -0.762,0; 2 0.762,0
C3216 = smd 1.6 x 1.8: 1 -1.651,0; 2 1.651,0
C3225 = smd 1.6 x 2.7: 1 -1.397,0; 2 1.397,0
C0805 = smd 1.2 x 1.3: 1 -1.016,0; 2 1.016,0
C2012 = smd 1.3 x 1.5: 1 -1.016,0; 2 1.016,0
C1608- = smd 0.8 x 0.8: 1 -0.762,0; 2 0.762,0
C3528-21/T = smd 1.778 x 2.286: + 1.524,0; - -1.524,0
D/7343-31W = smd 2.95 x 2.7: + 3.375,0; - -3.375,0
SOT23 = smd 1 x 1.4: D 0,-1.1; G 0.95,1.1; S -0.95,1.1
SMC = smd 2.8 x 3.8: A 3.7,0; C -3.7,0
1812L = smd 2.03 x 3.3: P$1 -2.16,0; P$2 2.16,0
SOT23-5L = smd 0.55 x 1.2: 1 -0.95,-1.3; 2 0,-1.3; 3 0.95,-1.3; 4 0.95,1.3; 5 -0.95,1.3
SO8 = smd 0.6 x 1.6: 1 -1.905,-2.6; 2 -0.635,-2.6; 3 0.635,-2.6; 4 1.905,-2.6; 5 1.905,2.6; 6 0.635,2.6; 7 -0.635,2.6; 8 -1.905,2.6
PW_R-PDSO-G16 = smd 0.4 x 1.2: 1 -2.275,-2.9; 2 -1.625,-2.9; 3 -0.975,-2.9; 4 -0.325,-2.9; 5 0.325,-2.9; 6 0.975,-2.9; 7 1.625,-2.9; 8 2.275,-2.9; 9 2.275,2.9; 10 1.625,2.9; 11 0.975,2.9; 12 0.325,2.9; 13 -0.325,2.9; 14 -0.975,2.9; 15 -1.625,2.9; 16 -2.275,2.9
SOT23-5L_FAN3100 = smd 0.7 x 1: 1 -0.95,-1.3; 2 0,-1.3; 3 0.95,-1.3; 4 0.95,1.3; 5 -0.95,1.3
SOT23-5 = smd 0.55 x 1.2: 1 -0.95,-1.3; 2 0,-1.3; 3 0.95,-1.3; 4 0.95,1.3; 5 -0.95,1.3
S08-EP1 = smd 0.8 x 2.2: 1 -1.905,-2.87; 2 -0.635,-2.87; 3 0.635,-2.87; 4 1.905,-2.87; 5 1.905,2.87; 6 0.635,2.87; 7 -0.635,2.87; 8 -1.905,2.87 | smd 3.7 x 2.71: EX_PAD 0,0
MSOP8 = smd 0.4 x 1.2: 1 -0.975,-2.05; 2 -0.325,-2.05; 3 0.325,-2.05; 4 0.975,-2.05; 5 0.975,2.05; 6 0.325,2.05; 7 -0.325,2.05; 8 -0.975,2.05
SOT223-4 = smd 1.2 x 2.2: 1 -2.311,-3.1; 2 0,-3.1; 3 2.311,-3.1 | smd 3.6 x 2.2: 4 0,3.1
SOIC16N = smd 0.6 x 2.2: 1 -4.445,-2.6; 2 -3.175,-2.6; 3 -1.905,-2.6; 4 -0.635,-2.6; 5 0.635,-2.6; 6 1.905,-2.6; 7 3.175,-2.6; 8 4.445,-2.6; 9 4.445,2.6; 10 3.175,2.6; 11 1.905,2.6; 12 0.635,2.6; 13 -0.635,2.6; 14 -1.905,2.6; 15 -3.175,2.6; 16 -4.445,2.6
TQFP48 = smd 0.3 x 1: 1 -2.75,-4.5; 2 -2.25,-4.5; 3 -1.75,-4.5; 4 -1.25,-4.5; 5 -0.75,-4.5; 6 -0.25,-4.5; 7 0.25,-4.5; 8 0.75,-4.5; 9 1.25,-4.5; 10 1.75,-4.5; 11 2.25,-4.5; 12 2.75,-4.5; 25 2.75,4.5; 26 2.25,4.5; 27 1.75,4.5; 28 1.25,4.5; 29 0.75,4.5; 30 0.25,4.5; 31 -0.25,4.5; 32 -0.75,4.5; 33 -1.25,4.5; 34 -1.75,4.5; 35 -2.25,4.5; 36 -2.75,4.5 | smd 1 x 0.3: 13 4.5,-2.75; 14 4.5,-2.25; 15 4.5,-1.75; 16 4.5,-1.25; 17 4.5,-0.75; 18 4.5,-0.25; 19 4.5,0.25; 20 4.5,0.75; 21 4.5,1.25; 22 4.5,1.75; 23 4.5,2.25; 24 4.5,2.75; 37 -4.5,2.75; 38 -4.5,2.25; 39 -4.5,1.75; 40 -4.5,1.25; 41 -4.5,0.75; 42 -4.5,0.25; 43 -4.5,-0.25; 44 -4.5,-0.75; 45 -4.5,-1.25; 46 -4.5,-1.75; 47 -4.5,-2.25; 48 -4.5,-2.75
SOT23-5' = smd 0.6 x 1.2: 1 -0.95,-1.306; 2 0,-1.306; 3 0.95,-1.306; 4 0.95,1.306; 5 -0.95,1.306
SOT223 = smd 1.219 x 2.235: 1 -2.311,-3.099; 2 0,-3.099; 3 2.311,-3.099 | smd 3.6 x 2.2: 4 0,3.099
SPC4077 = drill 0.8 pad 2.184 long: 1 -3,0; 2 0,-4.8 | drill 1 pad 2.184 long: 3 3,0
PJ-327-2 = drill 0.8 long: 1 -2.4,-1.9; 2 2.4,-4.8; 3 -2.4,-8.7; 4 2.4,-10.6 | hole 1.6: 0,-2.5; 0,-8.5
ED350V-02P = drill 1.5 pad 2.54: 1 -1.75,0; 2 1.75,0
2X03 = drill 1.016 square: 1 -2.54,-1.27 | drill 1.016 octagon: 2 -2.54,1.27; 3 0,-1.27; 4 0,1.27; 5 2.54,-1.27; 6 2.54,1.27
2X02 = drill 1.016 square: 1 -1.27,-1.27 | drill 1.016 octagon: 2 -1.27,1.27; 3 1.27,-1.27; 4 1.27,1.27
2X05M = drill 0.914 square: 1 -4,-1 | drill 0.914: 2 -4,1; 3 -2,-1; 4 -2,1; 5 0,-1; 6 0,1; 7 2,-1; 8 2,1; 9 4,-1; 10 4,1
2X12_SMD = smd 1 x 3.5: 1 -13.97,2.535; 2 -13.97,-2.535; 3 -11.43,2.535; 4 -11.43,-2.535; 5 -8.89,2.535; 6 -8.89,-2.535; 7 -6.35,2.535; 8 -6.35,-2.535; 9 -3.81,2.535; 10 -3.81,-2.535; 11 -1.27,2.535; 12 -1.27,-2.535; 13 1.27,2.535; 14 1.27,-2.535; 15 3.81,2.535; 16 3.81,-2.535; 17 6.35,2.535; 18 6.35,-2.535; 19 8.89,2.535; 20 8.89,-2.535; 21 11.43,2.535; 22 11.43,-2.535; 23 13.97,2.535; 24 13.97,-2.535
1X04M = drill 0.914 square: 1 -3,0 | drill 0.914: 2 -1,0; 3 1,0; 4 3,0
1X02M = drill 0.914 square: 1 -1,0 | drill 0.914: 2 1,0
0207/2V = drill 0.813 octagon: 1 -1.27,0; 2 1.27,0
SHP1260P-F = smd 2.2 x 5: 1 -5.8,0; 2 5.8,0
L0805 = smd 1.2 x 1.3: 1 -1.016,0; 2 1.016,0
ACT45B = smd 1.35 x 0.9: 1 -2.275,1.25; 2 -2.275,-1.25; 3 2.275,-1.25; 4 2.275,1.25
L0603 = smd 0.8 x 0.8: 1 -0.762,0; 2 0.762,0
ANG200X = drill 0.8 octagon: 1 -4.3,-1.6 | drill 0.8: 2 -1.1,-1.6; 3 1.1,-1.6; 4 3.3,-1.6; 5 3.3,1.6; 6 1.1,1.6; 7 -1.1,1.6; 8 -4.3,1.6
MPT3 = smd 0.6 x 1.4: BASE -1.5,-2; EMITTER 1.5,-2 | smd 0.6 x 0.8: COLLECTOR 0,-2.3
SOT323 = smd 0.5 x 0.65: 1 0.65,-0.775; 2 -0.65,-0.775; 3 0,0.775
MC-306 = smd 1.3 x 1.9: 1 -2.75,-1.6; 2 2.75,-1.6; 3 2.75,1.6; 4 -2.75,1.6
SMD5032 = smd 1.8 x 1.2: 1 -2,-1.2; 2 2,-1.2; 3 2,1.2; 4 -2,1.2
R0603 = smd 0.8 x 0.8: 1 -0.762,0; 2 0.762,0
R0603@1 = smd 0.8 x 0.8: 1 -0.762,0; 2 0.762,0
CSS-1210TB = smd 1 x 2.5: 1 -3.15,3.75; 2 -1.15,3.75; 3 0.85,3.75 | drill 0.8 square: P$1 -3.15,0; P$2 3.15,0
3266W = drill 0.6: 1 -2.6,-1.23; 2 0,1.23; 3 2.6,-1.23
USB-A-H = drill 0.914: D+ 2.4,-1; D- 2.4,1; GND 2.4,-3.5; VBUS 2.4,3.5 | drill 2.2: GND@1 0,5.8; GND@2 0,-5.8
SMB = smd 1.62 x 2.18: A 2.11,0; C -2.11,0

### Placement (x,y rotation side)
BAT1  62,39 180 top
C1  -19,-9 0 top  (outside the outline)
C2  -14,22 0 top  (outside the outline)
C3  -19,-13 0 top  (outside the outline)
C4  -13,-9 90 top  (outside the outline)
C5  -14,28 0 top  (outside the outline)
C6  -12,-20 0 top  (outside the outline)
C7  -4,62 0 top  (outside the outline)
C8  -3,52 180 top
C9  64.28,-34.62 90 top  (outside the outline)
C10  4,60 0 top
C11  1,52 0 top
C12  19.9,-36.8 270 top  (outside the outline)
C13  86,52 180 top
C14  40.17,-43.47 0 top  (outside the outline)
C15  65,1 0 top
C16  4,58 0 top
C17  27.85,-44.15 180 top  (outside the outline)
C18  27.88,-48.7 180 top  (outside the outline)
C19  70,0 0 top
C20  88,56 90 top
C21  80,56 90 top
C22  40.77,-48.17 180 top  (outside the outline)
C23  99,63 90 top  (outside the outline)
C24  101,63 270 top  (outside the outline)
C25  10,94 0 top  (outside the outline)
C26  10,92 0 top  (outside the outline)
C27  12,91 0 top  (outside the outline)
C28  2,90 0 top  (outside the outline)
C29  31.07,-53.47 270 top  (outside the outline)
C30  107,42 180 top  (outside the outline)
C31  28.55,-53.45 270 top  (outside the outline)
C32  107,40 180 top  (outside the outline)
C33  26.5,-52.5 270 top  (outside the outline)
C34  110,40 0 top  (outside the outline)
C35  116,8 0 top  (outside the outline)
C36  114,60 270 top  (outside the outline)
C37  101,43 0 top  (outside the outline)
C38  3,89 0 top  (outside the outline)
C39  41,85 0 top  (outside the outline)
C40  -8,78 180 top  (outside the outline)
C41  -8,81 0 top  (outside the outline)
C42  -4,79 0 top  (outside the outline)
C43  105,36 0 top  (outside the outline)
C44  -10,83 0 top  (outside the outline)
C45  53,84 0 top  (outside the outline)
C46  -12,70 0 top  (outside the outline)
C47  113,36 0 top  (outside the outline)
C48  24,95 0 top  (outside the outline)
C49  113,38 0 top  (outside the outline)
C50  27,95 0 top  (outside the outline)
C51  27,93 0 top  (outside the outline)
C52  29,98 0 top  (outside the outline)
C53  50,53 0 top
C54  38,53 0 top
C55  39,44 0 top
C56  50,43 0 top
C57  60,47 90 top
C58  57,43 0 top
C59  28,91 0 top  (outside the outline)
C60  78,86 0 top  (outside the outline)
C61  74,107 0 top  (outside the outline)
C62  37,55 270 top
C63  74,92 180 top  (outside the outline)
C64  73,105 0 top  (outside the outline)
C65  56,48 180 top
C66  57,54 0 top
C67  37,50 0 top
C68  32,48 0 top
C69  41,57 90 top
C70  40,57 90 top
C71  45,57 270 top
C72  135,61 90 top  (outside the outline)
C73  122,62 90 top  (outside the outline)
D1  60.7,-33.7 0 top  (outside the outline)
D2  34.15,-39.78 90 top  (outside the outline)
D3  49.12,-53.83 90 top  (outside the outline)
D4  46,87 0 top  (outside the outline)
D5  -9,74 0 top  (outside the outline)
D6  57,87 0 top  (outside the outline)
D7  79,81 180 top  (outside the outline)
D8  77,104 0 top  (outside the outline)
D9  53,41 270 top
F1  27.77,-32.2 180 top  (outside the outline)
F2  115,13 90 top  (outside the outline)
IC1  -24,30 0 top  (outside the outline)
IC2  -18,35 0 top  (outside the outline)
IC3  -4,-14 0 top  (outside the outline)
IC4  -2,57 0 top
IC5  68,-3 0 top
IC6  83,56 0 top
IC7  33.85,-47.95 90 top  (outside the outline)
IC8  7,88 0 top  (outside the outline)
IC9  107,61 0 top  (outside the outline)
IC10  110,29 0 top  (outside the outline)
IC11  -14,74 0 top  (outside the outline)
IC12  23,92 90 top  (outside the outline)
IC13  44,49 90 top
IC14  LT1783  [SOT23-5']  74,85 0 top  (outside the outline)
IC15  LT1783  [SOT23-5']  73,101 0 top  (outside the outline)
IC16  34,54 90 top
IC17  128,63 0 top  (outside the outline)
J1  10.84,11.41 0 top
J2  88.02,39.66 270 top
JP1  -29,-5 0 top  (outside the outline)
JP2  75.16,13.14 0 top
JP3  77.72,5.77 0 top
JP4  22,67 0 top
JP5  50.98,64.97 180 bottom
JP6  -28,24 0 top  (outside the outline)
JP7  -21,24 0 top  (outside the outline)
JP8  67,-8 0 top  (outside the outline)
JP9  7,53 270 top
JP10  43,-14 180 top  (outside the outline)
JP11  -10,57 90 top  (outside the outline)
JP12  4,98 0 top  (outside the outline)
JP13  54,-14 180 top  (outside the outline)
JP14  42,94 0 top  (outside the outline)
JP15  23,101 0 top  (outside the outline)
JP16  -17,85 0 top  (outside the outline)
JP17  54,94 0 top  (outside the outline)
JP18  120,37 0 top  (outside the outline)
JP19  120,29 0 top  (outside the outline)
JP20  41,37 0 top
JP21  30,45 90 top
JP22  88,88 0 top  (outside the outline)
JP23  87,104 0 top  (outside the outline)
L1  -18,-22 0 top  (outside the outline)
L2  -18,-17 0 top  (outside the outline)
L3  43.8,-32.12 0 top  (outside the outline)
L4  112,8 0 top  (outside the outline)
L5  103,39 0 top  (outside the outline)
L6  -14,79 180 top  (outside the outline)
L7  37,41 180 top
L8  43,57 270 top
Q1  -29,3 0 top  (outside the outline)
Q2  23,76 180 top  (outside the outline)
Q3  28,76 180 top  (outside the outline)
Q4  -25,-23 0 top  (outside the outline)
Q5  -28,-15 0 top  (outside the outline)
Q6  -20,-28 0 top  (outside the outline)
Q7  -18,0 90 top  (outside the outline)
Q8  -14,34 0 top  (outside the outline)
Q9  -14,-27 0 top  (outside the outline)
Q10  -30,34 90 top  (outside the outline)
Q11  -10,31 180 top  (outside the outline)
Q12  42,-7 0 top  (outside the outline)
Q13  54,-7 0 top  (outside the outline)
Q14  107,13 0 top  (outside the outline)
Q15  55,46 180 top
Q16  56,51 0 top
Q30  43,0 0 top
Q31  54,0 0 top
R1  -21,36 0 top  (outside the outline)
R2  23,79 0 top  (outside the outline)
R3  28,79 180 top  (outside the outline)
R4  -24,34 0 top  (outside the outline)
R5  23,73 180 top
R6  28,73 180 top
R7  -13,-3 90 top  (outside the outline)
R8  -13,-16 90 top  (outside the outline)
R9  -19,39 180 top  (outside the outline)
R10  -10,-12 90 top  (outside the outline)
R11  -11,-16 90 top  (outside the outline)
R13  -10,-7 90 top  (outside the outline)
R15  -9,35 0 top  (outside the outline)
R16  -23,38 180 top  (outside the outline)
R17  63.17,-37.33 180 top  (outside the outline)
R18  66.58,-34.42 270 top  (outside the outline)
R19  65,-3 0 top
R20  27.85,-42.62 180 top  (outside the outline)
R21  25.18,-49.05 270 top  (outside the outline)
R22  72,-5 90 top  (outside the outline)
R23  25.52,-43.38 270 top  (outside the outline)
R24  7,92 0 top  (outside the outline)
R25  4,92 0 top  (outside the outline)
R26  39.85,-46.05 0 top  (outside the outline)
R27  10,97 0 top  (outside the outline)
R28  40.77,-49.65 180 top  (outside the outline)
R29  108,17 0 top  (outside the outline)
R30  111,15 0 top  (outside the outline)
R31  111,11 0 top  (outside the outline)
R32  111,13 0 top  (outside the outline)
R33  108,9 180 top  (outside the outline)
R34  111,42 0 top  (outside the outline)
R35  11,88 270 top  (outside the outline)
R36  27.88,-47.3 180 top  (outside the outline)
R37  25.9,-45.78 0 top  (outside the outline)
R38  114,40 0 top  (outside the outline)
R39  2,86 0 top  (outside the outline)
R40  41,89 0 top  (outside the outline)
R41  41,87 0 top  (outside the outline)
R42  -19,79 90 top  (outside the outline)
R43  22,96 0 top  (outside the outline)
R44  21,95 0 top  (outside the outline)
R45  25,96 0 top  (outside the outline)
R46  53,88 0 top  (outside the outline)
R47  53,86 0 top  (outside the outline)
R48  21,89 0 top  (outside the outline)
R49  26,88 0 top  (outside the outline)
R50  78,89 0 top  (outside the outline)
R51  72,98 180 top  (outside the outline)
R52  74,89 180 top  (outside the outline)
R53  78,100 0 top  (outside the outline)
R54  33,46 0 top
R55  33,44 0 top
R56  54,38 0 top
R57  82,87 0 top  (outside the outline)
R58  80,104 0 top  (outside the outline)
R59  34,58 180 top
R60  34,51 90 top
R61  38,34 0 top
R62  43,34 0 top
SW1  -24,73 270 top  (outside the outline)
VR1  -20,30 0 top  (outside the outline)
VR2  -13,39 0 top  (outside the outline)
VR3  -22,43 0 top  (outside the outline)
VR4  69,87 270 top  (outside the outline)
VR5  68,103 90 top  (outside the outline)
VR6  31,54 270 top
X1  84.94,13.23 180 top
ZD1  28.95,-37.4 90 top  (outside the outline)

### Tracks (layer width: path | path; a pad name or v marks a point on that pad's centre or on a via)
+1.2V_REF  (6 unrouted)
+3V3  (19 unrouted)
+5V  (37 unrouted)
+5V/1  (7 unrouted)
+10V  (11 unrouted)
+12V  (3 unrouted)
+UB  (1 unrouted)
AGND  (50 unrouted)
BOOT1  (2 unrouted)
CAN_RX  (1 unrouted)
CAN_TX  (1 unrouted)
CANH  (4 unrouted)
CANL  (4 unrouted)
COMP1_P  (4 unrouted)
COMP2_P  (4 unrouted)
D+  (2 unrouted)
D-  (1 unrouted)
DAC1_OUT1  (2 unrouted)
DAC2_OUT1  (2 unrouted)
DC-IN  (2 unrouted)
DC_IN_ADC  (4 unrouted)
GND  (70 unrouted)
  pour Bottom: 0,70 88,70 88,62.3 71.2,62.3 71.2,45 88,45 88,0 74.2,0 74.2,9 35,9 35,0 0,0 0,47 18,47 18,63.5 0,63.5
  pour Top: 0,70 88,70 88,62.3 71.2,62.3 71.2,45 88,45 88,0 74.2,0 74.2,9 35,9 35,0 0,0 0,47 18,47 18,63.5 0,63.5
KELVIN_M  (1 unrouted)
KELVIN_P  (1 unrouted)
L1  (1 unrouted)
L2  (1 unrouted)
L3  (1 unrouted)
LC_PULSE  (4 unrouted)
LEFT  (1 unrouted)
N$1  (3 unrouted)
N$2  (1 unrouted)
N$3  (2 unrouted)
N$4  (1 unrouted)
N$5  (2 unrouted)
N$6  (2 unrouted)
N$7  (1 unrouted)
N$8  (1 unrouted)
N$9  (3 unrouted)
N$10  (1 unrouted)
N$11  (1 unrouted)
N$12  (1 unrouted)
N$13  (3 unrouted)
N$14  (1 unrouted)
N$15  (1 unrouted)
N$16  (1 unrouted)
N$17  (2 unrouted)
N$18  (3 unrouted)
N$19  (2 unrouted)
N$20  (1 unrouted)
N$21  (1 unrouted)
N$22  (1 unrouted)
N$23  (2 unrouted)
N$24  (1 unrouted)
N$25  (2 unrouted)
N$26  (1 unrouted)
N$27  (1 unrouted)
N$28  (1 unrouted)
N$29  (1 unrouted)
N$30  (2 unrouted)
N$31  (1 unrouted)
N$32  (3 unrouted)
N$33  (1 unrouted)
N$34  (1 unrouted)
N$35  (2 unrouted)
N$36  (2 unrouted)
N$37  (1 unrouted)
N$38  (5 unrouted)
N$39  (2 unrouted)
N$40  (1 unrouted)
N$41  (3 unrouted)
N$42  (3 unrouted)
N$43  (1 unrouted)
N$44  (1 unrouted)
N$45  (2 unrouted)
N$46  (1 unrouted)
N$47  (1 unrouted)
N$48  (4 unrouted)
N$49  (1 unrouted)
N$50  (1 unrouted)
N$51  (1 unrouted)
N$52  (1 unrouted)
N$53  (1 unrouted)
N$54  (1 unrouted)
N$55  (1 unrouted)
N$56  (1 unrouted)
N$57  (1 unrouted)
N$58  (1 unrouted)
N$59  (3 unrouted)
N$60  (1 unrouted)
N$61  (1 unrouted)
N$62  (1 unrouted)
N$63  (1 unrouted)
N$64  (1 unrouted)
N$65  (1 unrouted)
N$66  (1 unrouted)
N$67  (1 unrouted)
N$68  (5 unrouted)
N$69  (2 unrouted)
N$70  (3 unrouted)
N$71  (1 unrouted)
N$72  (1 unrouted)
N$73  (1 unrouted)
N$74  (4 unrouted)
N$75  (1 unrouted)
N$76  (1 unrouted)
N$77  (2 unrouted)
N$78  (1 unrouted)
N$79  (1 unrouted)
N$80  (1 unrouted)
N$81  (1 unrouted)
N$82  (1 unrouted)
N$83  (1 unrouted)
N$84  (1 unrouted)
N$85  (1 unrouted)
N$86  (1 unrouted)
N$87  (2 unrouted)
N$88  (1 unrouted)
N$89  (1 unrouted)
N$90  (1 unrouted)
N$92  (2 unrouted)
N$95  (2 unrouted)
N$96  (2 unrouted)
PWM1  (2 unrouted)
RANGE_SET  (1 unrouted)
RELAY1  (1 unrouted)
RELAY2  (1 unrouted)
RIGHT  (1 unrouted)
RXD_LA  (4 unrouted)
RXD_STM  (1 unrouted)
RXI2  (1 unrouted)
SWCLK  (2 unrouted)
SWDIO  (2 unrouted)
TC1_ADC  (3 unrouted)
TC2_ADC  (3 unrouted)
TXD_LA  (4 unrouted)
TXD_STM  (1 unrouted)
TXO2  (1 unrouted)
UART_RXI  (2 unrouted)
UART_TXO  (2 unrouted)
USB_DM  (1 unrouted)
USB_DP  (1 unrouted)
USB_EN  (3 unrouted)
V-OUT  (3 unrouted)
VDD  (4 unrouted)
VEE  (2 unrouted)
VPP  (9 unrouted)

### Text on the board
_tplace: OUT1 | GND | OUT2 | GND | CH3 | CH2 | CH1 | CH0 | RESET | POWER S/W | DC6V~30V IN | 1CELL LIFO BAT | - | LCD 5V CON | + | FAN | LEFT | RIGHT | GND | +5V | SW | - | + | - | + | AUDIO IN
_bplace: Design By : cona05@naver.com | Raspberry Pi B Type | V1.2 | STAND ALONE PI SHIELD